# EasyEDA Pro project ProProject_cload_F411_2motor_2spi sensor_2024-05-27.epro

# Schematic Schematic1
Create Date: 2023-12-01; Page Name: P1; Project Name: cload_F411_2motor_2spi sensor; Schematic Name: Schematic1; Update Date: 2023-12-20; Company: 嘉立创EDA; Page Size: A4; Version: V1.0
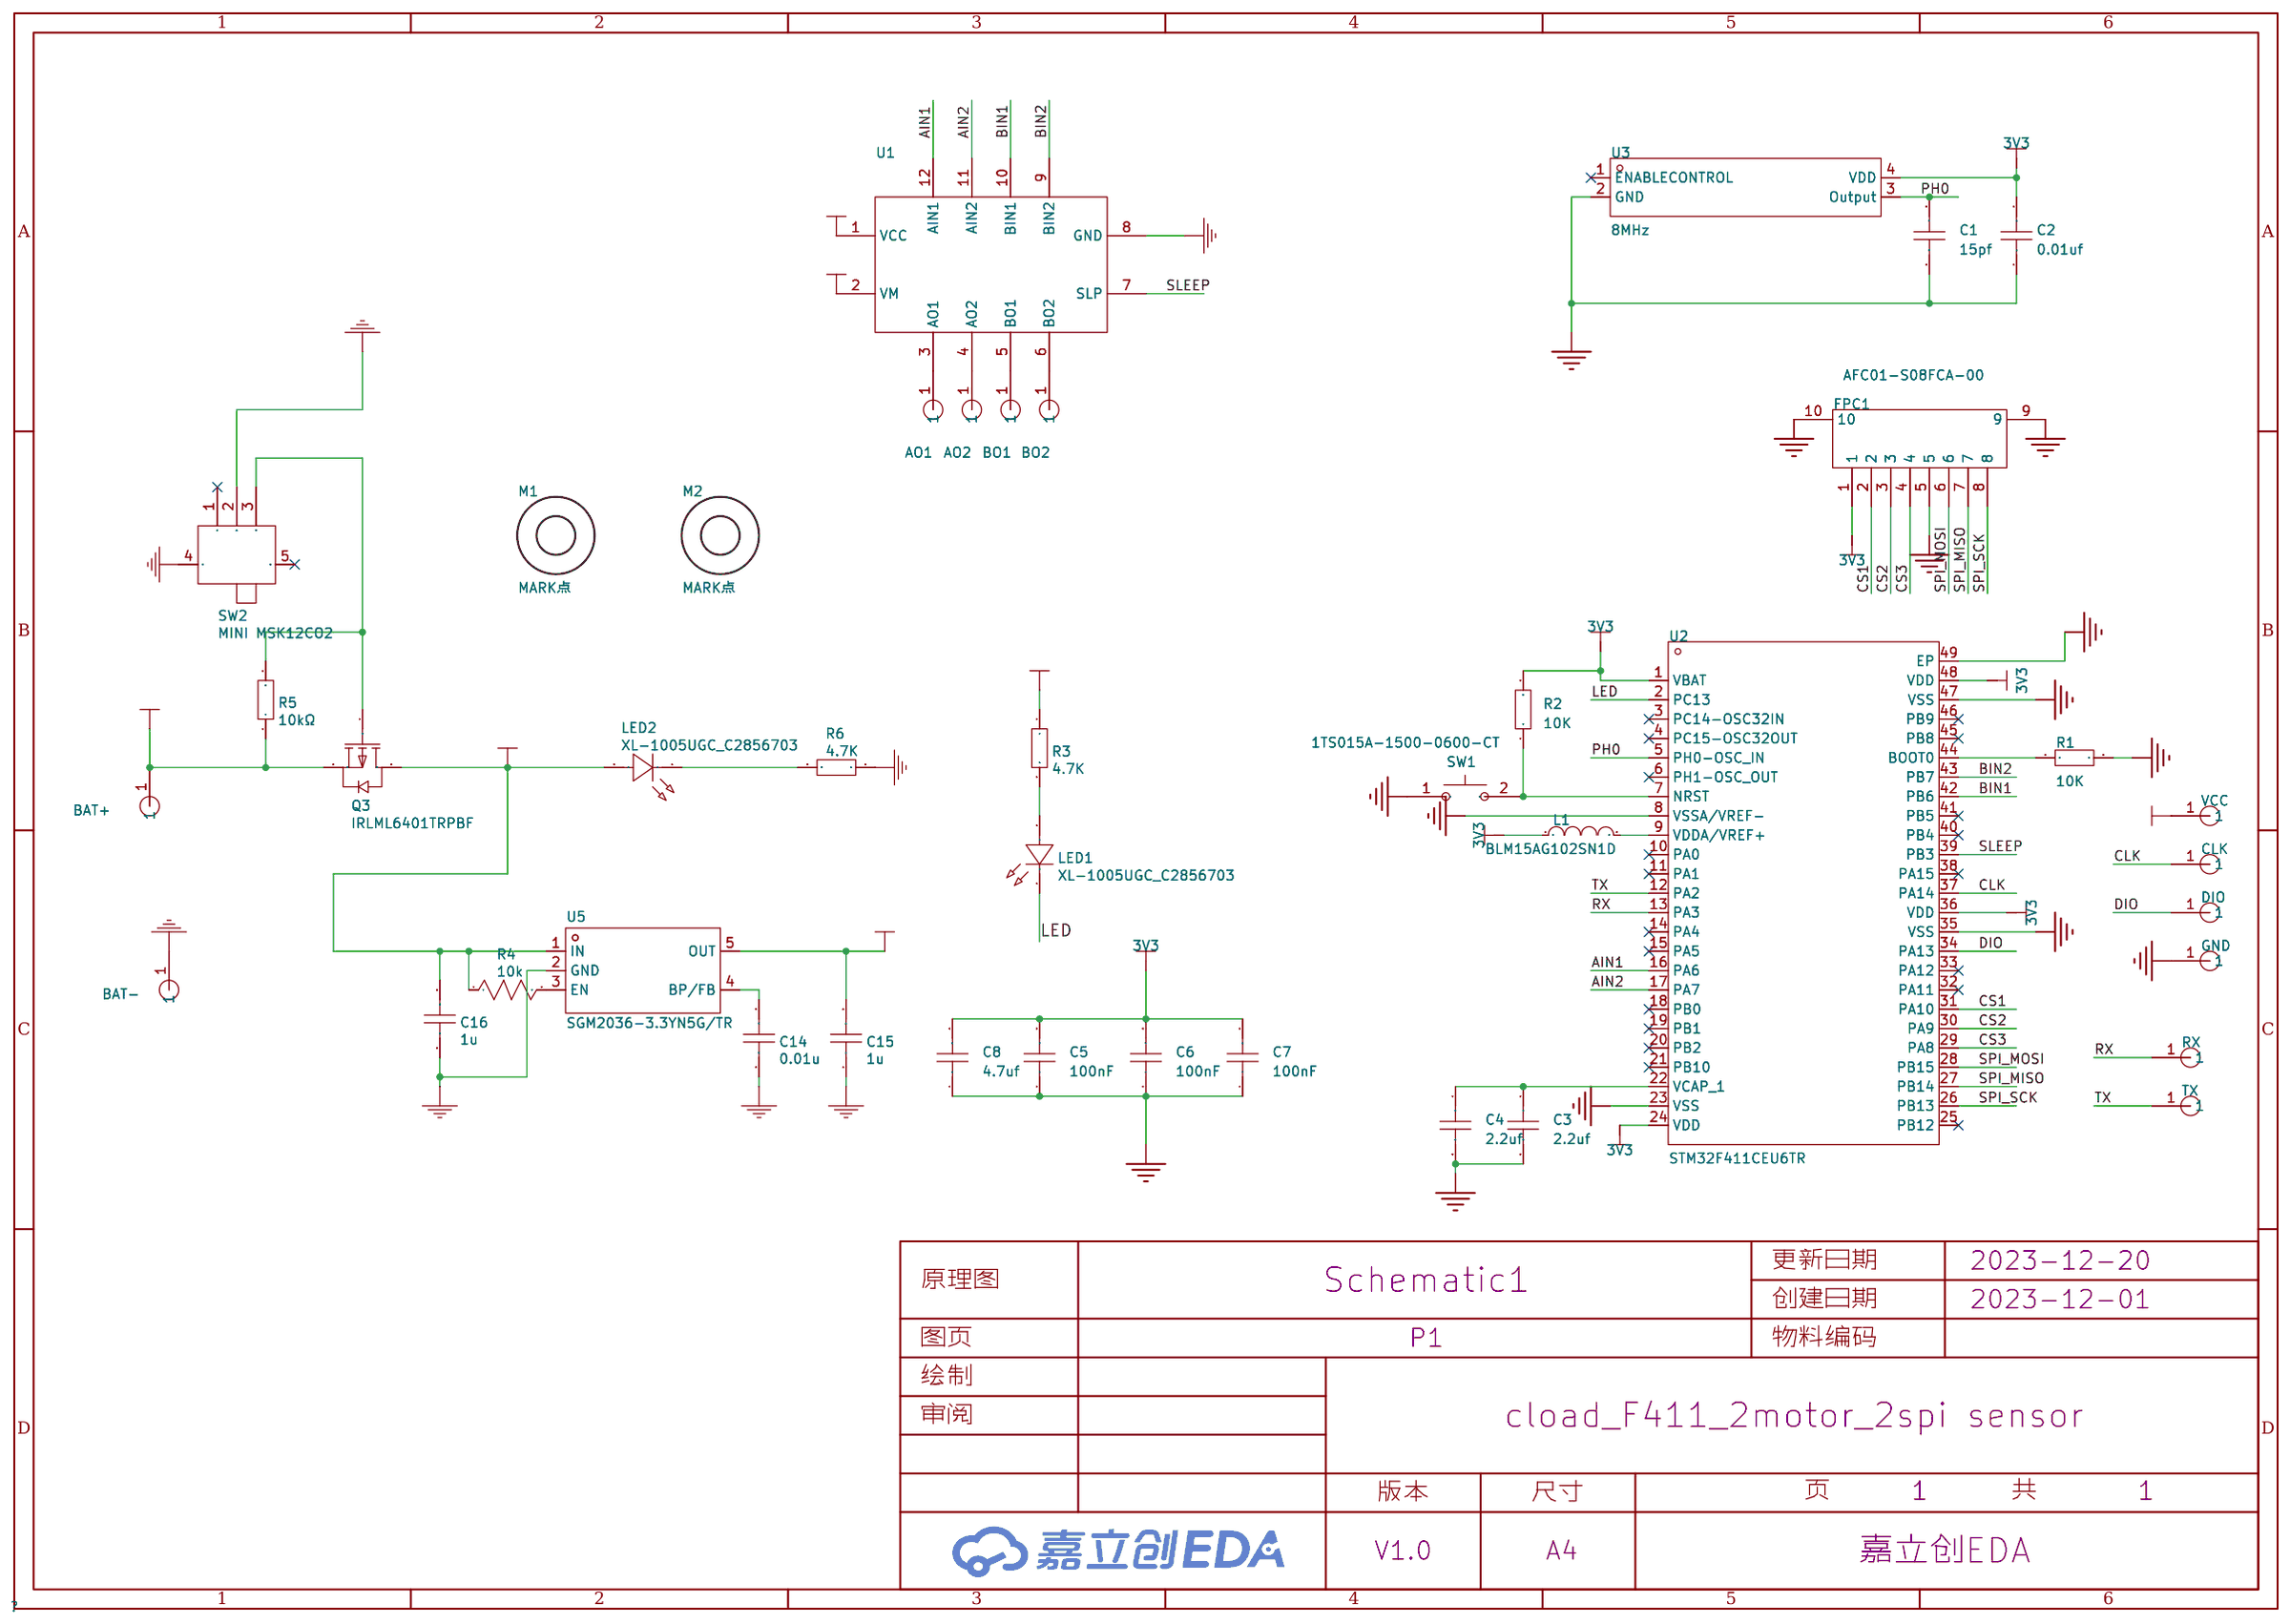
[diagram p0: schematic sheet]

## Parts
AO1  TESTPOINT_D1.5mm  [BAT_PAD]
AO2  TESTPOINT_D1.5mm  [BAT_PAD]
BAT+  TESTPOINT_D1.5mm  [BAT_PAD]
BAT-  TESTPOINT_D1.5mm  [BAT_PAD]
BO1  TESTPOINT_D1.5mm  [BAT_PAD]
BO2  TESTPOINT_D1.5mm  [BAT_PAD]
C1  15pf  [C0402]
C2  0.01uf  [C0402]
C3  2.2uf  [C0402]
C4  2.2uf  [C0402]
C5  100nF  [C0402]
C6  100nF  [C0402]
C7  100nF  [C0402]
C8  4.7uf  [C0402]
C14  0.01u  [C0402]
C15  1u  [C0402]
C16  1u  [C0402]
CLK  TESTPOINT_D1.5mm  [TESTPAD-1.5mm]
DIO  TESTPOINT_D1.5mm  [TESTPAD-1.5mm]
FPC1  AFC01-S08FCA-00  [FPC-SMD_P0.50-8P_FGS-XJ-H2.0]
GND  TESTPOINT_D1.5mm  [TESTPAD-1.5mm]
L1  BLM15AG102SN1D  [L0402]
LED1  XL-1005UGC_C2856703  [LED0402-RD_GREEN]
LED2  XL-1005UGC_C2856703  [LED0402-RD_GREEN]
M1  MARK点  [MARK点]
M2  MARK点  [MARK点]
Q3  IRLML6401TRPBF  [SOT-23-3_L2.9-W1.3-P1.90-LS2.4-BR]
R1  10K  [R0402]
R2  10K  [R0402]
R3  4.7K  [R0402]
R4  10k  [R0402]
R5  10kΩ  [R0402]
R6  4.7K  [R0402]
RX  TESTPOINT_D1.5mm  [TESTPAD-1.5mm]
SW1  1TS015A-1500-0600-CT  [SW-SMD_L3.0-W2.0-LS3.5]
SW2  MINI MSK12CO2  [SW-SMD_MSK12CO2]
TX  TESTPOINT_D1.5mm  [TESTPAD-1.5mm]
U1  -  [DOUBLE_DRV8210]
U2  STM32F411CEU6TR  [UFQFPN-48_L7.0-W7.0-P0.50-BL-EP5.6]
U3  8MHz  [OSC-SMD_4P-L2.0-W1.6-BL]
U5  SGM2036-3.3YN5G/TR  [SOT-23-5_L3.0-W1.7-P0.95-LS2.8-BR]
VCC  TESTPOINT_D1.5mm  [TESTPAD-1.5mm]

## Library data of the parts
AO1 AO2 BAT+ BAT- BO1 BO2 CLK DIO GND RX TX VCC = TESTPOINT_D1.5mm
C1-C8 = CAP_0402: Supplier Footprint: 0402
C14 = 0.01u: link: https://item.szlcsc.com/15869.html; 3DModel: C0402_L1.0-W0.5-H0.5
C15 C16 = 1u: link: https://item.szlcsc.com/15869.html; 3DModel: C0402_L1.0-W0.5-H0.5
FPC1 = AFC01-S08FCA-00: 间距:0.5mm;触点数量:8P;锁定特性:翻盖式;触点类型:下接;安装类型:卧贴;; LCSC Part Name: 间距:0.5mm P数:8P 翻盖式 下接; Supplier Part: C262657; Manufacturer: JS(钜硕电子); Supplier Footprint: SMD,P=0.5mm; JLCPCB Part Class: 扩展库; Datasheet: https://atta.szlcsc.com/upload/public/pdf/source/20190816/C413942_2A72D1AC756EAE17EEDF756A339D4500.pdf; Supplier: LCSC; Pitch: 0.5mm; Number of Contacts: 8P; Locking Feature: 翻盖式; FFC, FCB Thickness: 0.3mm; Contact Type: 下接; Mounting Type: 卧贴; Height Above Board: 2mm
L1 = BLM15AG102SN1D: 标称阻抗@测试频率:1kΩ@100MHz;误差:±25%;直流电阻(RDC):650mΩ;; LCSC Part Name: 单路 0402磁珠 阻抗1kΩ@100MHz; Supplier Part: C76883; Manufacturer: muRata(村田); Supplier Footprint: 0402; JLCPCB Part Class: 扩展库; Datasheet: https://atta.szlcsc.com/upload/public/pdf/source/20180326/C76883_ADEF09E524709ED697F1DAE2F534F275.pdf; Supplier: LCSC; Impedance @ Frequency: 1kΩ@100MHz; Tolerance: ±25%; DC Resistance: 650mΩ; Current Rating: 300mA; Circuits: 1
LED1 LED2 = XL-1005UGC_C2856703: link: https://so.szlcsc.com/global.html?k=C2856703&amp;ref=editor; 3DModel: LED0402_L1.0-W0.5-H0.2; Supplier: LCSC; Supplier Part: C2856703; Manufacturer: XINGLIGHT(成兴光); Manufacturer Part: XL-1005UGC; JLCPCB Part Class: Extended Part
M1 M2 = MARK点: _: 3
Q3 = IRLML6401TRPBF: link: https://so.szlcsc.com/global.html?k=C3034&amp;ref=editor; 3DModel: SOT-23-3P_L2.9-W1.3-H1.0-LS2.4-P0.95; Supplier: LCSC; Manufacturer: Infineon(英飞凌); Supplier Part: C3034; JLCPCB Part Class: Extended Part
R1 R2 = Res_0402: Supplier Footprint: 0402
R3 R6 = 4.7K: link: https://so.szlcsc.com/global.html?k=C60490&amp;ref=editor; 3DModel: R0402_L1.0-W0.5-H0.5; Supplier: LCSC; Manufacturer: YAGEO(国巨); Manufacturer Part: RC0402FR-0710KL; Supplier Part: C60490; JLCPCB Part Class: Extended Part
R4 = 10k: link: https://item.szlcsc.com/323315.html; 3DModel: R0402_L1.0-W0.5-H0.5
R5 = 10kΩ: link: https://so.szlcsc.com/global.html?k=C60490&amp;ref=editor; 3DModel: R0402_L1.0-W0.5-H0.5; Supplier: LCSC; Manufacturer: YAGEO(国巨); Manufacturer Part: RC0402FR-0710KL; Supplier Part: C60490; JLCPCB Part Class: Extended Part
SW1 = 1TS015A-1500-0600-CT: 触点电流:50mA;额定电压(DC):12V;额定功率:0.6W;绝缘电阻:100MΩ;电路结构:单刀单掷;安装方式:立贴;带灯:无;作用力:150gf@±30gf;机械寿命:30万次;带支架:否;; LCSC Part Name: 3*2*0.6mm 立贴 轻触开关 防水; Supplier Part: C319434; Manufacturer: HYP(鸿源精密); Supplier Footprint: SMD,2x3mm; JLCPCB Part Class: 扩展库; Datasheet: https://atta.szlcsc.com/upload/public/pdf/source/20181106/C319434_B3AA23CF9D2B2E70128718BA7D32871A.pdf; Supplier: LCSC; Contact Current: 50mA; Voltage Rating (DC): 12V; Power Rating: 0.6W; Insulation Resistance: 100MΩ; Circuit: 单刀单掷; Mounting Style: 立贴; Actuator Style: 圆形按钮; Actuator/Cap Color: 黑色; With Lamp: 无; Operating Force: 150gf@±30gf; Mechanical Life: 30万次; Operating Temperature: -40℃~+90℃; IP Rating: IP68; Pin Style: SMD接片; Switch Length: 3mm; Switch Width: 2mm; Switch Height: 0.6mm; Strike Gundam: 否
SW2 = MINI MSK12CO2: link: https://so.szlcsc.com/global.html?k=C2681570&amp;ref=editor; Supplier: LCSC; Supplier Part: C2681570; Manufacturer: SHOU HAN(首韩); JLCPCB Part Class: Extended Part
U1 = DOUBLE_DRV8210
U2 = STM32F411CEU6TR: Supplier Part: C2054095; Manufacturer: ST(意法半导体); Supplier Footprint: UFQFPN-48(7x7); JLCPCB Part Class: 扩展库; Datasheet: https://atta.szlcsc.com/upload/public/pdf/source/20210609/C2054095_D420176800F9A9DECA745BDC6F5392BE.pdf; Supplier: LCSC
U3 = SX1M8.000M10F30TNN: 频率:8MHz;工作电压:1.62V~3.63V;输出模式:CMOS;频率稳定度:±10ppm;; LCSC Part Name: 8MHz ±10ppm 1.62V~3.63V CMOS; Supplier Part: C2901607; Manufacturer: SCTF(星通时频); Supplier Footprint: SMD2016-4P; JLCPCB Part Class: 扩展库; Datasheet: https://atta.szlcsc.com/upload/public/pdf/source/20211019/00ED133043D4FFB3578E73FB4951C66C.pdf; Supplier: LCSC; Supply Voltage: 1.62V~3.63V; Supply Current (Max): 10mA; Output Type: CMOS; Frequency Stability: ±10ppm; Operating Temperature: -40℃~+85℃
U5 = SGM2036-3.3YN5G/TR: 输出类型:固定;输出极性:正;输出通道数:1;最大输入电压:5.5V;输出电压:3.3V;压差:250mV@(300mA);输出电流:300mA;电源纹波抑制比(PSRR):82dB;; LCSC Part Name: 正 Vin=5.5V Vout=3.3V 300mA 82dB; Supplier Part: C92402; Manufacturer: SGMICRO(圣邦微); Supplier Footprint: SOT-23-5; JLCPCB Part Class: 扩展库; Datasheet: https://atta.szlcsc.com/upload/public/pdf/source/20170919/C92402_1505787431852977326.pdf; Supplier: LCSC; Output Type: 固定; Output Polarity: 正; Number of Outputs: 1; Maximum Input Voltage: 5.5V; Output Voltage: 3.3V; Dropout Voltage: 250mV@(300mA); Output Current: 300mA; Power Supply Rejection Ratio (PSRR): 82dB

## Nets
3V3: C2.2 C5.2 C6.2 C7.2 C8.2 C15.2 FPC1.1 L1.1 R2.2 R3.1 U1.1(VCC) U2.1(VBAT) U2.24(VDD) U2.36(VDD) U2.48(VDD) U3.4(VDD) U5.5(OUT)
GND: BAT-.1 C1.1 C2.1 C3.2 C4.2 C5.1 C6.1 C7.1 C8.1 C14.1 C15.1 C16.1 FPC1.5 FPC1.9 FPC1.10 GND.1 R1.2 R6.1 SW1.1 SW2.2 SW2.4 U1.8(GND) U2.8(VSSA/VREF-) U2.23(VSS) U2.35(VSS) U2.47(VSS) U2.49(EP) U3.2(GND) U5.2(GND)
VBAT: BAT+.1 Q3.2(S) R5.1
VCC: C16.2 LED2.2(A) Q3.3(D) R4.1 U1.2(VM) U5.1(IN) VCC.1
AIN1: U1.12(AIN1) U2.16(PA6)
AIN2: U1.11(AIN2) U2.17(PA7)
BIN1: U1.10(BIN1) U2.42(PB6)
BIN2: U1.9(BIN2) U2.43(PB7)
CLK: CLK.1 U2.37(PA14)
CS1: FPC1.2 U2.31(PA10)
CS2: FPC1.3 U2.30(PA9)
CS3: FPC1.4 U2.29(PA8)
DIO: DIO.1 U2.34(PA13)
LED: LED1.1(K) U2.2(PC13)
PH0: C1.2 U2.5(PH0-OSC_IN) U3.3(Output)
RX: RX.1 U2.13(PA3)
SLEEP: U1.7(SLP) U2.39(PB3)
SPI_MISO: FPC1.7 U2.27(PB14)
SPI_MOSI: FPC1.6 U2.28(PB15)
SPI_SCK: FPC1.8 U2.26(PB13)
TX: TX.1 U2.12(PA2)
$1N799: R1.1 U2.44(BOOT0)
$1N916: C3.1 C4.1 U2.22(VCAP_1)
$1N1281: L1.2 U2.9(VDDA/VREF+)
$1N1484: R2.1 SW1.2 U2.7(NRST)
$1N2332: Q3.1(G) R5.2 SW2.3
$1N2340: LED2.1(K) R6.2
$1N2343: C14.2 U5.4(BP/FB)
$1N2459: R4.2 U5.3(EN)
$1N3041: AO1.1 U1.3(AO1)
$1N3064: AO2.1 U1.4(AO2)
$1N3087: BO1.1 U1.5(BO1)
$1N3110: BO2.1 U1.6(BO2)
$1N3175: LED1.2(A) R3.2

Not connected (* = marked no-connect by the designer): SW2 1* 5*; U2 3(PC14-OSC32IN)* 4(PC15-OSC32OUT)* 6(PH1-OSC_OUT)* 10(PA0)* 11(PA1)* 14(PA4)* 15(PA5)* 18(PB0)* 19(PB1)* 20(PB2)* 21(PB10)* 25(PB12)* 32(PA11)* 33(PA12)* 38(PA15)* 40(PB4)* 41(PB5)* 45(PB8)* 46(PB9)*; U3 1(ENABLECONTROL)*

# Board PCB1
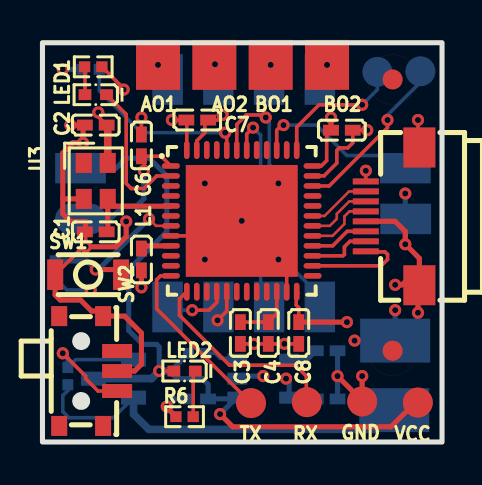
[diagram p1: board, top side]
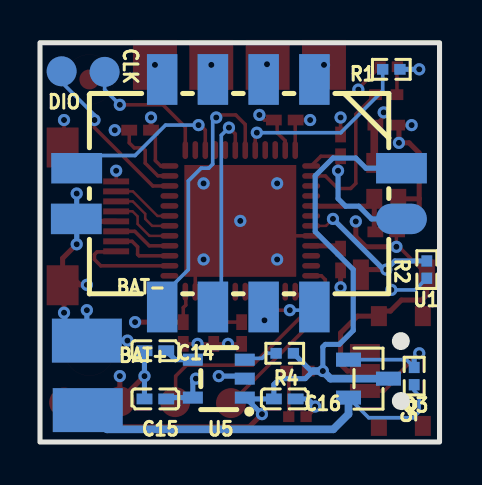
[diagram p2: board, bottom side, seen from below]

Outline 20 x 20 mm; copper layers: Top Layer, GND, VCC, Bottom Layer. Coordinates in mm from the lower left corner of the outline.
Outline path: rectangle 0,20 20,0
Stack: Top Layer 0.035mm 外层铜厚1oz / Dielectric1 0.2104mm 7628 RC49% 8.6mil / GND 0.0152mm 内层铜厚 / Dielectric2 1.065mm 1.1mm H/HOZ 含铜 / VCC 0.0152mm 内层铜厚 / Dielectric3 0.2104mm 7628 RC49% 8.6mil / Bottom Layer 0.035mm 外层铜厚1oz

## Design rules (mm)
template: 自定义配置
spacing copperThickness1oz (default): track to track 0.102, other pairs 0 to 0.3
spacing copperThickness2oz: track to track 0.203, other pairs 0.152 to 0.3
track width copperThickness1oz (default): min 0.127, default 0.254, max 2.54
track width copperThickness2oz: min 0.203, default 0.254, max 2.54
differential pair differentialPair (default): width min 0.127, default 0.254, max 2.54; gap min 0.152, default 0.152
via viaSize: diameter min 0.5, default 0.61, max 10; hole min 0.3, default 0.305, max 6.299
via 4layer_viaSize (default): diameter min 0.249, default 0.351, max 10; hole min 0.15, default 0.201, max 6.299
net GND uses innerPlane

## Placement (name value [footprint] x y rotation side)
AO1  TESTPOINT_D1.5mm  [bat_pad]  5.78 18.89 0 top
AO2  TESTPOINT_D1.5mm  [bat_pad]  8.6 18.89 0 top
BAT+  TESTPOINT_D1.5mm  [BAT_PAD]  17.61 1.6 270 bottom
BAT-  TESTPOINT_D1.5mm  [BAT_PAD]  17.65 5.08 270 bottom
BO1  TESTPOINT_D1.5mm  [bat_pad]  11.42 18.89 0 top
BO2  TESTPOINT_D1.5mm  [bat_pad]  14.24 18.89 0 top
C1  15pf  [C0402]  2.67 10.53 0 top
C2  0.01uf  [C0402]  2.67 15.88 0 top
C3  2.2uf  [C0402]  9.91 5.46 270 top
C4  2.2uf  [C0402]  11.3 5.46 270 top
C5  100nF  [C0402]  14.99 15.62 180 top
C6  100nF  [C0402]  4.95 14.86 270 top
C7  100nF  [C0402]  7.75 16.13 180 top
C8  4.7uf  [C0402]  12.83 5.46 90 top
C14  0.01u  [C0402]  14.22 4.57 180 bottom
C15  1u  [C0402]  14.22 2.16 180 bottom
C16  1u  [C0402]  7.75 2.16 0 bottom
CLK  TESTPOINT_D1.5mm  [TESTPAD-1.5mm]  16.76 18.54 180 bottom
DIO  TESTPOINT_D1.5mm  [TESTPAD-1.5mm]  18.92 18.57 180 bottom
FPC1  AFC01-S08FCA-00  [FPC-SMD_P0.50-8P_FGS-XJ-H2.0]  17.53 11.3 270 top
GND  TESTPOINT_D1.5mm  [TESTPAD-1.5mm]  16 2.03 0 top
L1  BLM15AG102SN1D  [L0402]  4.95 9.14 90 top
LED1  XL-1005UGC_C2856703  [LED0402-RD_GREEN]  2.67 17.4 180 top
LED2  XL-1005UGC_C2856703  [LED0402-RD_GREEN]  7.11 3.56 180 top
M1  -  [MARK点]  17.53 4.57 0 top
M2  -  [MARK点]  17.53 18.16 0 top
Q3  IRLML6401TRPBF  [SOT-23-3_L2.9-W1.3-P1.90-LS2.4-BR]  3.56 3.17 0 bottom
R1  10K  [R0402]  2.41 18.67 180 bottom
R2  10K  [R0402]  0.63 8.64 270 bottom
R3  4.7K  [R0402]  2.54 18.8 180 top
R4  10k  [R0402]  7.75 4.44 0 bottom
R5  10kΩ  [R0402]  1.27 3.3 90 bottom
R6  4.7K  [R0402]  7.11 1.27 0 top
RX  TESTPOINT_D1.5mm  [TESTPAD-1.5mm]  13.23 2 0 top
SW1  1TS015A-1500-0600-CT  [SW-SMD_L3.0-W2.0-LS3.5]  2.29 8.38 0 top
SW2  MINI MSK12CO2  [SW-SMD_MSK12CO2]  2.29 3.56 270 top
TX  TESTPOINT_D1.5mm  [TESTPAD-1.5mm]  10.44 1.95 0 top
U1  -  [DOUBLE_DRV8210]  2.54 7.37 0 bottom
U2  STM32F411CEU6TR  [UFQFPN-48_L7.0-W7.0-P0.50-BL-EP5.6]  9.97 11.08 270 top
U3  8MHz  [OSC-SMD_4P-L2.0-W1.6-BL]  2.67 13.08 270 top
U5  SGM2036-3.3YN5G/TR  [SOT-23-5_L3.0-W1.7-P0.95-LS2.8-BR]  11.05 3.17 180 bottom
VCC  TESTPOINT_D1.5mm  [TESTPAD-1.5mm]  18.79 1.98 0 top

## Footprints (pads in the part's own frame, mm; a bottom-side part is the same pattern mirrored in y, then rotated)
bat_pad
  rect 2.2x2.5 smd: 1(0,0)
BAT_PAD
  rect 2.2x3.5 smd: 1(0,0)
C0402
  rect 0.79x0.54 smd: 1(-0.545,0) 2(0.545,0)
DOUBLE_DRV8210
  oval 2.54x1.524 smd: 1(-0.635,-3.81)
  rect 2.54x1.524 smd: 2(-0.635,-6.35) 7(15.621,-6.35) 8(15.642,-3.81)
  rect 1.524x2.54 smd: 3(3.723,-10.795) 4(6.263,-10.795) 5(8.803,-10.795) 6(11.343,-10.795) 9(11.343,0.602) 10(8.803,0.602) 11(6.263,0.602) 12(3.723,0.602)
FPC-SMD_P0.50-8P_FGS-XJ-H2.0
  rect 0.3x1.3 smd: 1(-1.75,-1.34) 2(-1.252,-1.339) 3(-0.75,-1.34) 4(-0.25,-1.34) 5(0.25,-1.34) 6(0.75,-1.34) 7(1.25,-1.34) 8(1.75,-1.34)
  rect 2x1.6 smd: 9(3.45,1.34) 10(-3.45,1.34)
L0402
  rect 0.79x0.54 smd: 1(-0.545,0) 2(0.545,0)
LED0402-RD_GREEN
  rect 0.636x0.54 smd: 1(-0.538,0) 2(0.538,0)
MARK点
  round 1 smd: 1(0,0)
OSC-SMD_4P-L2.0-W1.6-BL
  rect 1x0.8 smd: 1(-0.9,-0.6) 2(0.9,-0.6) 3(0.9,0.6) 4(-0.9,0.6)
R0402
  rect 0.566x0.54 smd: 1(-0.433,0) 2(0.433,0)
SOT-23-3_L2.9-W1.3-P1.90-LS2.4-BR
  rect 1.25x0.7 smd: 1(1,-0.95) 2(1,0.95) 3(-1,0)
SOT-23-5_L3.0-W1.7-P0.95-LS2.8-BR
  rect 1x0.6 smd: 1(1.3,-0.95) 2(1.3,0) 3(1.3,0.95) 4(-1.3,0.95) 5(-1.3,-0.95)
SW-SMD_L3.0-W2.0-LS3.5
  rect 0.8x1.524 smd: 1(-1.651,0) 2(1.651,0)
SW-SMD_MSK12CO2
  rect 0.7x1.5 smd: 1(-1,1.45) 2(0,1.45) 3(1,1.45)
  rect 1x0.8 smd: 4(-2.75,0.75) 5(2.75,0.75) 6(-2.75,-1.45) 7(2.75,-1.45)
TESTPAD-1.5mm
  round 1.5 smd: 1(0,0)
UFQFPN-48_L7.0-W7.0-P0.50-BL-EP5.6
  oval 0.28x0.9 smd: 1(-2.751,-3.547) 2(-2.251,-3.547) 3(-1.75,-3.547) 4(-1.25,-3.547) 5(-0.75,-3.547) 6(-0.249,-3.547) 7(0.249,-3.547) 8(0.75,-3.547) 9(1.25,-3.547) 10(1.75,-3.547) 11(2.251,-3.547) 12(2.751,-3.547) 25(2.751,3.547) 26(2.251,3.547) 27(1.75,3.547) 28(1.25,3.547) 29(0.75,3.547) 30(0.249,3.547) 31(-0.249,3.547) 32(-0.75,3.547) 33(-1.25,3.547) 34(-1.75,3.547) 35(-2.251,3.547) 36(-2.751,3.547)
  oval 0.9x0.28 smd: 13(3.547,-2.75) 14(3.547,-2.25) 15(3.547,-1.75) 16(3.547,-1.25) 17(3.547,-0.75) 18(3.547,-0.25) 19(3.547,0.25) 20(3.547,0.75) 21(3.547,1.25) 22(3.547,1.75) 23(3.547,2.25) 24(3.547,2.75) 37(-3.547,2.751) 38(-3.547,2.251) 39(-3.547,1.75) 40(-3.547,1.25) 41(-3.547,0.75) 42(-3.547,0.249) 43(-3.547,-0.249) 44(-3.547,-0.75) 45(-3.547,-1.25) 46(-3.547,-1.75) 47(-3.547,-2.251) 48(-3.547,-2.751)
  rect 5.6x5.6 smd: 49(0,0)

## Nets
As in the schematic.

Pads without a net: M1 1; M2 1; SW2 1 5 6 7; U2 3 4 6 10 11 14 15 18 19 20 21 25 32 33 38 40 41 45 46; U3 1

## Via types
v1: diameter 0.61, hole 0.305, Top Layer to Bottom Layer, 53 vias

## Routing (per net, layer and track width the routed paths; a pad name or vN(x,y) marks a point on that pad's centre or on a via; arc(x,y) is an arc through that point)
3V3: length 27.2
  Top Layer w0.178: v1(6.48,16.13) C7.2 7.22,16.11 7.22,14.62 ; R3.1 4.06,17.7 v1(4.06,17.65) ; v1(5.08,13.59) 5.08,14.19 C6.2 5.94,14.31 6.43,13.83 ; FPC1.1 v1(16.19,13.59) ; C5.2 14.22,15.4 14.22,14.1 13.95,13.83 U2.36 ; C8.2 12.83,6.73 12.7,6.86 12.7,7.51 U2.24 12.79,7.46 ; C2.2 2.79,16.29 v1(2.79,16.51)
  Top Layer w0.254: L1.1 v1(4.95,7.75) ; C8.2 v1(15.24,6.01) ; C5.2 v1(14.44,16.26)
  Top Layer w0.381: C2.2 3.27,15.82 3.27,13.98
  Bottom Layer w0.178: v1(6.48,16.13) 6.35,16.13 ; v1(2.41,7.62) 1.22,7.62 0.63,8.2
  Bottom Layer w0.254: C15.2 13.61,2.22 12.35,2.22 12.35,3.02 v1(12.19,3.17) ; v1(4.95,7.75) 4.83,7.75 ; v1(5.08,13.59) 5.08,12.19 4.7,11.81 4.04,11.81 3.4,11.18 U1.1
GND: length 69
  Top Layer w0.178: v1(16.26,15.62) 15.53,15.62 15.53,14.99 15.28,14.73 14.86,14.73 14.73,14.61 14.73,13.97 14.1,13.33 13.53,13.33 U2.35 ; v1(18.8,16.13) 18.8,15.71 18.87,15.64 ; v1(4.95,16.26) C6.1 ; C8.1 v1(12.11,4.92) C4.2 v1(10.59,4.92) C3.2 ; U2.23 12.22,8.83 v1(9.97,11.08) 9.22,10.33 6.43,10.33 ; v1(9.02,16.38) 8.76,16.13 C7.1 8.13,15.97 8.13,15.49 7.72,15.09 U2.47 ; 2.12,10.53 2.16,10.49 v1(2.16,9.78) 2.03,9.78 SW1.1
  Top Layer w0.254: v1(6.22,1.78) 6.22,1.73 R6.1 ; v1(4.19,11.05) 4.19,10.29 3.68,9.78 v1(2.16,9.78) ; 2.16,10.49 2.16,11.05 1.4,11.05 1.02,11.43 1.02,12.19 ; v1(17.65,7.87) 18,7.87 18.8,8.67 ; v1(16,3.3) 16,2.16 15.91,2.16 v1(14.77,3.3) ; v1(18.8,6.48) 18.8,8.67 ; 18.8,8.67 18.87,8.74 18.87,9.2 v1(18.16,9.91) 18.16,10.55 17.65,11.05 FPC1.5 ; 1.02,12.19 1.02,14.48 1.52,14.99 v1(2.03,14.99) 2.03,15.78 C2.1 v1(1.4,15.88) ; 1.02,12.19 1.02,12.18 U3.2 ; SW2.2 4.61,3.56 4.95,3.9 4.95,5.46 4.11,6.31 SW2.4 2.78,6.56 2.46,6.56 1.91,7.11 0.89,7.11 0.64,7.37 SW1.1
  Bottom Layer w0.178: BAT-.1 18.8,6.22 v1(18.8,6.48) ; v1(2.16,9.78) 2.12,9.78
  Bottom Layer w0.254: C15.1 v1(14.77,3.3) C14.1 ; R1.2 v1(1.02,18.67) ; C16.1 6.6,2.16 v1(6.22,1.78) ; v1(2.03,14.99) 2.03,15.15 ; v1(11.05,3.3) 9.88,3.3 U5.2 ; v1(18.16,12.45) 18.16,11.2 ; 18.16,11.2 U1.8 ; 18.16,11.2 v1(18.16,9.91) ; v1(15.62,5.08) BAT-.1 v1(17.65,6.6)
  vias: v1(8.13,12.95) v1(8.13,9.14) v1(11.81,12.95) v1(11.81,9.14)
VBAT: length 20.1
  Bottom Layer w0.178: R5.1 1.27,2.58 1.02,2.32 1.02,1.52 1.32,1.22 3.55,1.22 Q3.2
  Bottom Layer w0.381: BAT+.1 16.65,0.64 5.32,0.64 4.56,1.4 Q3.2
VCC: length 38.9
  Top Layer w0.178: v1(5.84,3.56) LED2.2
  Top Layer w0.254: 18.79,2.11 17.45,0.76 9.53,0.76 v1(8.89,1.4)
  Bottom Layer w0.254: 9.65,2.16 C16.2 8.29,2.88 8,3.17 6.72,3.17 6.34,3.56 6.43,3.56 R4.1 ; 9.65,2.16 9.68,2.16 U5.1 9.72,2.22 9.65,2.16 ; 9.65,2.16 v1(8.89,1.4) ; v1(5.84,3.56) 5.84,4.76 5.72,4.89 5.02,4.89 4.32,5.59 4.32,8.64 6.22,10.54 6.22,13.33 5.33,14.22 4.19,14.22 3.68,13.72 U1.2
  Bottom Layer w0.381: 6.34,3.56 v1(5.84,3.56) 5.46,3.17 Q3.3
AIN1: length 3.2
  Top Layer w0.178: U2.16 8.72,6.99 8.34,6.6 v1(7.49,6.6)
  Bottom Layer w0.178: U1.12 6.42,6.6 v1(7.49,6.6)
AIN2: length 2.3
  Top Layer w0.178: v1(8.76,6.1) 9.22,6.56 U2.17
  Bottom Layer w0.178: U1.11 8.8,6.14 v1(8.76,6.1)
BIN1: length 10.6
  Top Layer w0.178: 10.22,14.62 10.22,15.43 v1(10.54,15.75)
  Bottom Layer w0.178: v1(10.54,15.75) 10.92,15.37 10.92,7.19 U1.10
BIN2: length 13.8
  Top Layer w0.178: v1(11.18,16.26) 11.05,16.38 10.2,16.38 9.72,15.91 U2.43
  Bottom Layer w0.178: 13.88,6.76 13.34,7.31 13.34,7.87 12.57,8.64 12.57,13.08 11.94,13.72 11.56,13.72 11.35,13.92 11.35,16.08 v1(11.18,16.26)
CLK: length 6.9
  Top Layer w0.178: v1(16,16.89) 13.84,16.89 12.72,15.77 U2.37
  Bottom Layer w0.178: v1(16,16.89) 16.76,17.65 CLK.1
CS1: length 3.2
  Top Layer w0.127: 16.19,12.56 15.35,12.56 14.12,11.33 U2.31
CS2: length 3.3
  Top Layer w0.127: U2.30 14.38,10.83 14.73,11.18 14.73,11.43 15.35,12.05 FPC1.3
CS3: length 3.4
  Top Layer w0.127: U2.29 14.52,10.33 15.11,10.92 15.11,11.3 15.37,11.56 16.18,11.56 FPC1.4
DIO: length 8.5
  Top Layer w0.178: U2.34 14.35,12.83 17.27,15.75 v1(17.27,16.13)
  Bottom Layer w0.178: DIO.1 18.92,18.03 17.27,16.38 v1(17.27,16.13)
LED: length 7.5
  Top Layer w0.178: 6.43,13.33 5.72,13.33 5.09,12.7 4.44,12.7 4.19,12.95 4.19,16.41 LED1.1
PH0: length 5
  Top Layer w0.254: 6.43,11.83 6.41,11.81 3.64,11.81 U3.3 3.27,10.58 C1.2
RX: length 10.3
  Top Layer w0.178: U2.13 6.86,7.16 6.86,6.35 9.36,3.85 12.66,3.85 13.21,3.3 13.21,2.02 RX.1
SLEEP: length 8.4
  Top Layer w0.178: U2.39 11.72,15.62 11.98,15.88 v1(12.06,15.88)
  Bottom Layer w0.178: v1(12.06,15.88) 13.72,15.88 15.24,14.35 17.53,14.35 U1.7
SPI_MISO: length 3.2
  Top Layer w0.178: FPC1.7 15.39,10.05 15.11,9.78 15.11,9.4 15.04,9.33 U2.27
SPI_MOSI: length 3
  Top Layer w0.178: FPC1.6 15.25,10.55 14.53,9.83 U2.28
SPI_SCK: length 5.3
  Top Layer w0.178: U2.26 16.95,8.83 17.27,9.14 17.27,9.4 17.15,9.53 16.21,9.53 FPC1.8
TX: length 8.9
  Top Layer w0.178: TX.1 5.72,6.67 5.72,8.13 5.91,8.33 6.43,8.33
$1N799: length 9.1
  Top Layer w0.178: U2.44 9.22,15.41 v1(9.14,15.49)
  Bottom Layer w0.178: v1(9.14,15.49) 4.94,15.49 2.85,17.59 R1.1
$1N916: length 3.1
  Top Layer w0.178: U2.22 11.72,6.43 C4.1 C3.1
$1N1281: length 1.5
  Top Layer w0.254: L1.2 5.09,9.83 6.43,9.83
$1N1484: length 8.5
  Top Layer w0.127: v1(5.33,11.18) 5.68,10.83 6.43,10.83
  Top Layer w0.254: v1(2.67,8.64) 3.68,8.64 SW1.2
  Bottom Layer w0.254: v1(5.33,11.18) 2.79,8.64 v1(2.67,8.64) 2.23,9.07 R2.1
$1N2332: length 7.8
  Top Layer w0.178: v1(1.02,4.44) 2.16,3.3 2.16,3.17 2.78,2.56 SW2.3
  Bottom Layer w0.178: R5.2 1.66,4.12 Q3.1
  Bottom Layer w0.254: R5.2 1.27,4.19 v1(1.02,4.44)
$1N2340: length 2.3
  Top Layer w0.178: R6.2 7.54,3.45 LED2.1
$1N2343: length 1.5
  Bottom Layer w0.254: 12.35,4.12 13.23,4.12 C14.2
$1N2459: length 1.7
  Bottom Layer w0.178: U5.3 9.68,4.19 8.89,4.19 8.64,4.44 R4.2
$1N3041: length 0.9
  Bottom Layer w0.254: v1(5.78,18.89) 6.26,18.41 U1.3
$1N3064: length 0
  Top Layer w0.254: v1(8.63,18.92) AO2.1
$1N3087: length 0.8
  Bottom Layer w0.254: v1(11.42,18.89) 11.42,18.24 U1.5
$1N3110:
  vias: v1(14.24,18.89)
$1N3175: length 1.4
  Top Layer w0.178: R3.2 2.13,18.77 LED1.2

## Copper pours and planes (outline as drawn; the poured copper is in the pictures)
3V3 on VCC: 2,18 18,18 18,2 2,2
GND on GND: 0.26,19.74 19.74,19.74 19.74,0.26 0.26,0.26
